# Altium schematic sheet PIC32MM-Breakout.SchDoc
size A4; SheetNumber: 1; SheetTotal: 1
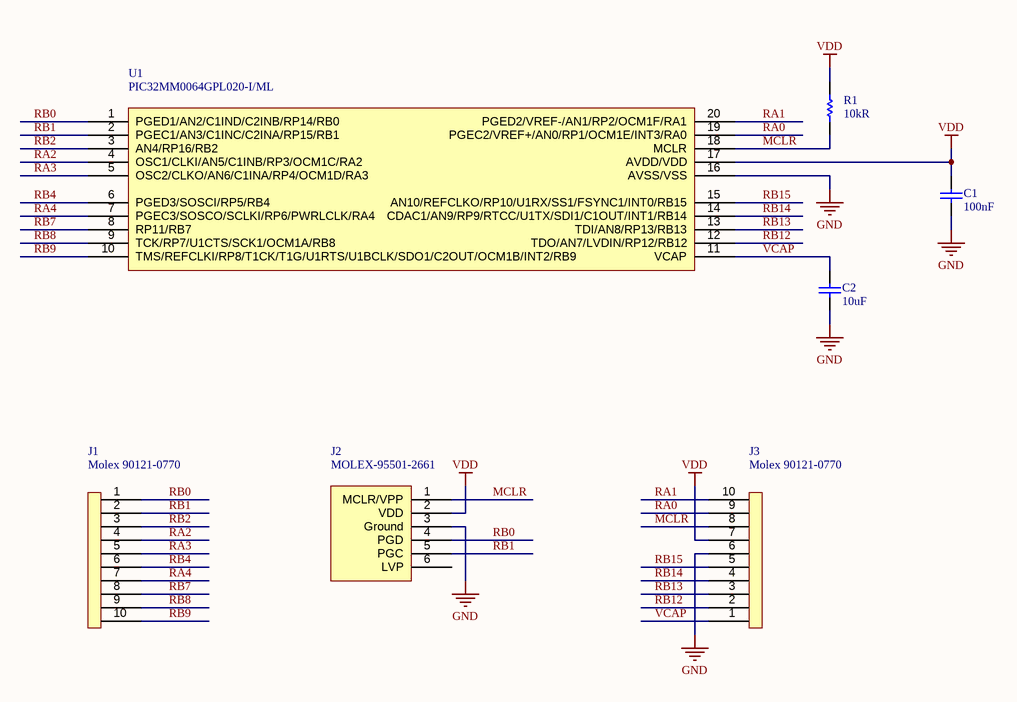
[diagram p0: PIC32MM-Breakout.SchDoc]

## Parts
C1  100nF  [Capacitor 0603]
C2  10uF  [Capacitor 0603]
J1  Molex 90121-0770  [Molex 90121-0770]
J2  MOLEX-95501-2661  [Molex 90120-0926]
J3  Molex 90121-0770  [Molex 90121-0770]
R1  10kR  [Resistor 0603]
U1  PIC32MM0064GPL020-I/ML  [QFN-20]

## Nets
GND: C1.1 C2.1 J2.3(Ground) J3.6 U1.16(AVSS/VSS)
VDD: C1.2 J2.2(VDD) J3.7 R1.2 U1.17(AVDD/VDD)
MCLR: J2.1(MCLR/VPP) J3.8 R1.1 U1.18(MCLR)
RA0: J3.9 U1.19(PGEC2/VREF+/AN0/RP1/OCM1E/INT3/RA0)
RA1: J3.10 U1.20(PGED2/VREF-/AN1/RP2/OCM1F/RA1)
RA2: J1.4 U1.4(OSC1/CLKI/AN5/C1INB/RP3/OCM1C/RA2)
RA3: J1.5 U1.5(OSC2/CLKO/AN6/C1INA/RP4/OCM1D/RA3)
RA4: J1.7 U1.7(PGEC3/SOSCO/SCLKI/RP6/PWRLCLK/RA4)
RB0: J1.1 J2.4(PGD) U1.1(PGED1/AN2/C1IND/C2INB/RP14/RB0)
RB1: J1.2 J2.5(PGC) U1.2(PGEC1/AN3/C1INC/C2INA/RP15/RB1)
RB2: J1.3 U1.3(AN4/RP16/RB2)
RB4: J1.6 U1.6(PGED3/SOSCI/RP5/RB4)
RB7: J1.8 U1.8(RP11/RB7)
RB8: J1.9 U1.9(TCK/RP7/U1CTS/SCK1/OCM1A/RB8)
RB9: J1.10 U1.10(TMS/REFCLKI/RP8/T1CK/T1G/U1RTS/U1BCLK/SDO1/C2OUT/OCM1B/INT2/RB9)
RB12: J3.2 U1.12(TDO/AN7/LVDIN/RP12/RB12)
RB13: J3.3 U1.13(TDI/AN8/RP13/RB13)
RB14: J3.4 U1.14(CDAC1/AN9/RP9/RTCC/U1TX/SDI1/C1OUT/INT1/RB14)
RB15: J3.5 U1.15(AN10/REFCLKO/RP10/U1RX/SS1/FSYNC1/INT0/RB15)
VCAP: C2.2 J3.1 U1.11(VCAP)

Not connected (* = marked no-connect by the designer): J2 6(LVP)

## Notes on the sheet
- TITLE
- SIZE
- A4
- VARIANT
- PROJECT
- SHEET
- VERSION
- OF
- AUTHOR
- DATE

## Library data of the parts
C1 C2 = Capacitor
J2 = MPLAB ICSP
R1 = Resistor